# EasyEDA Pro project firefly_rp2354A.eprj, schematic Schematic1

## Sheets
1 P1: Board Name: Board1; Create Date: 2026-09-29; Page Name: P1; Project Name: firefly_rp2354A; Schematic Name: Schematic1; Update Date: 2026-10-07; Company: EasyEDA.com; Page Size: A4; Version: V1.0
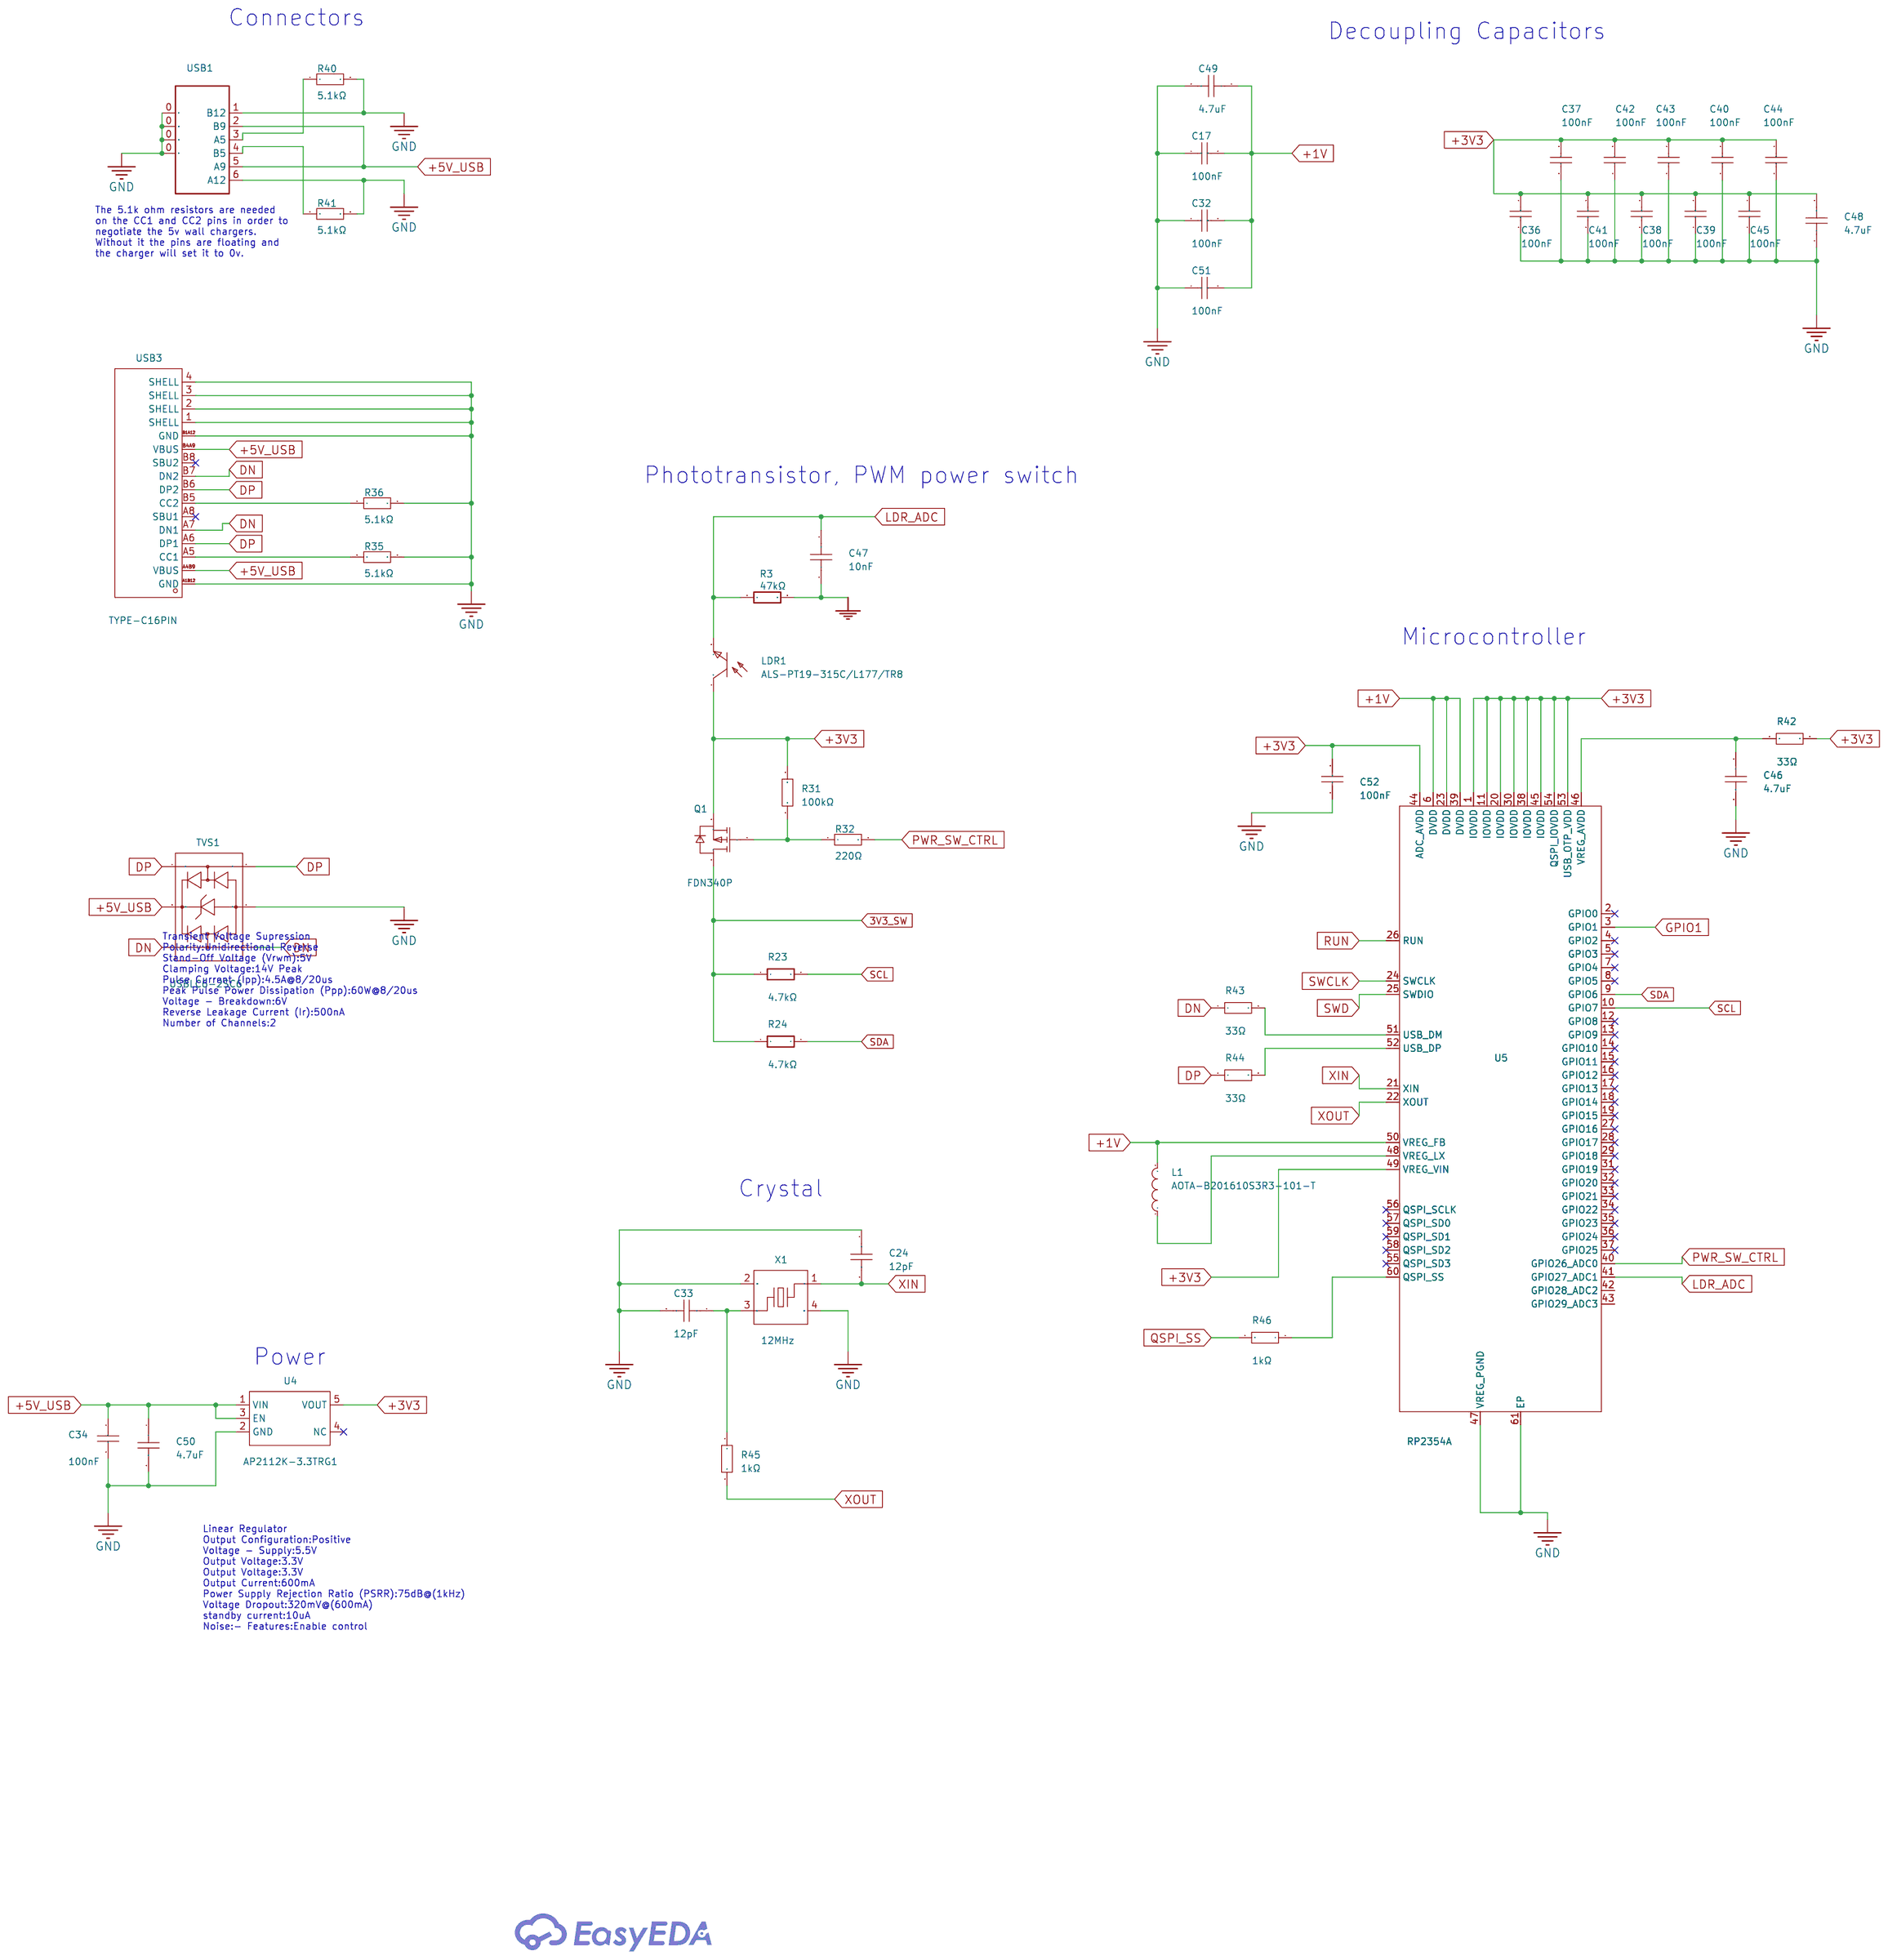
[diagram p0: P1]
2 P2: Create Date: 2026-10-05; Page Name: P2; Update Date: 2026-10-05
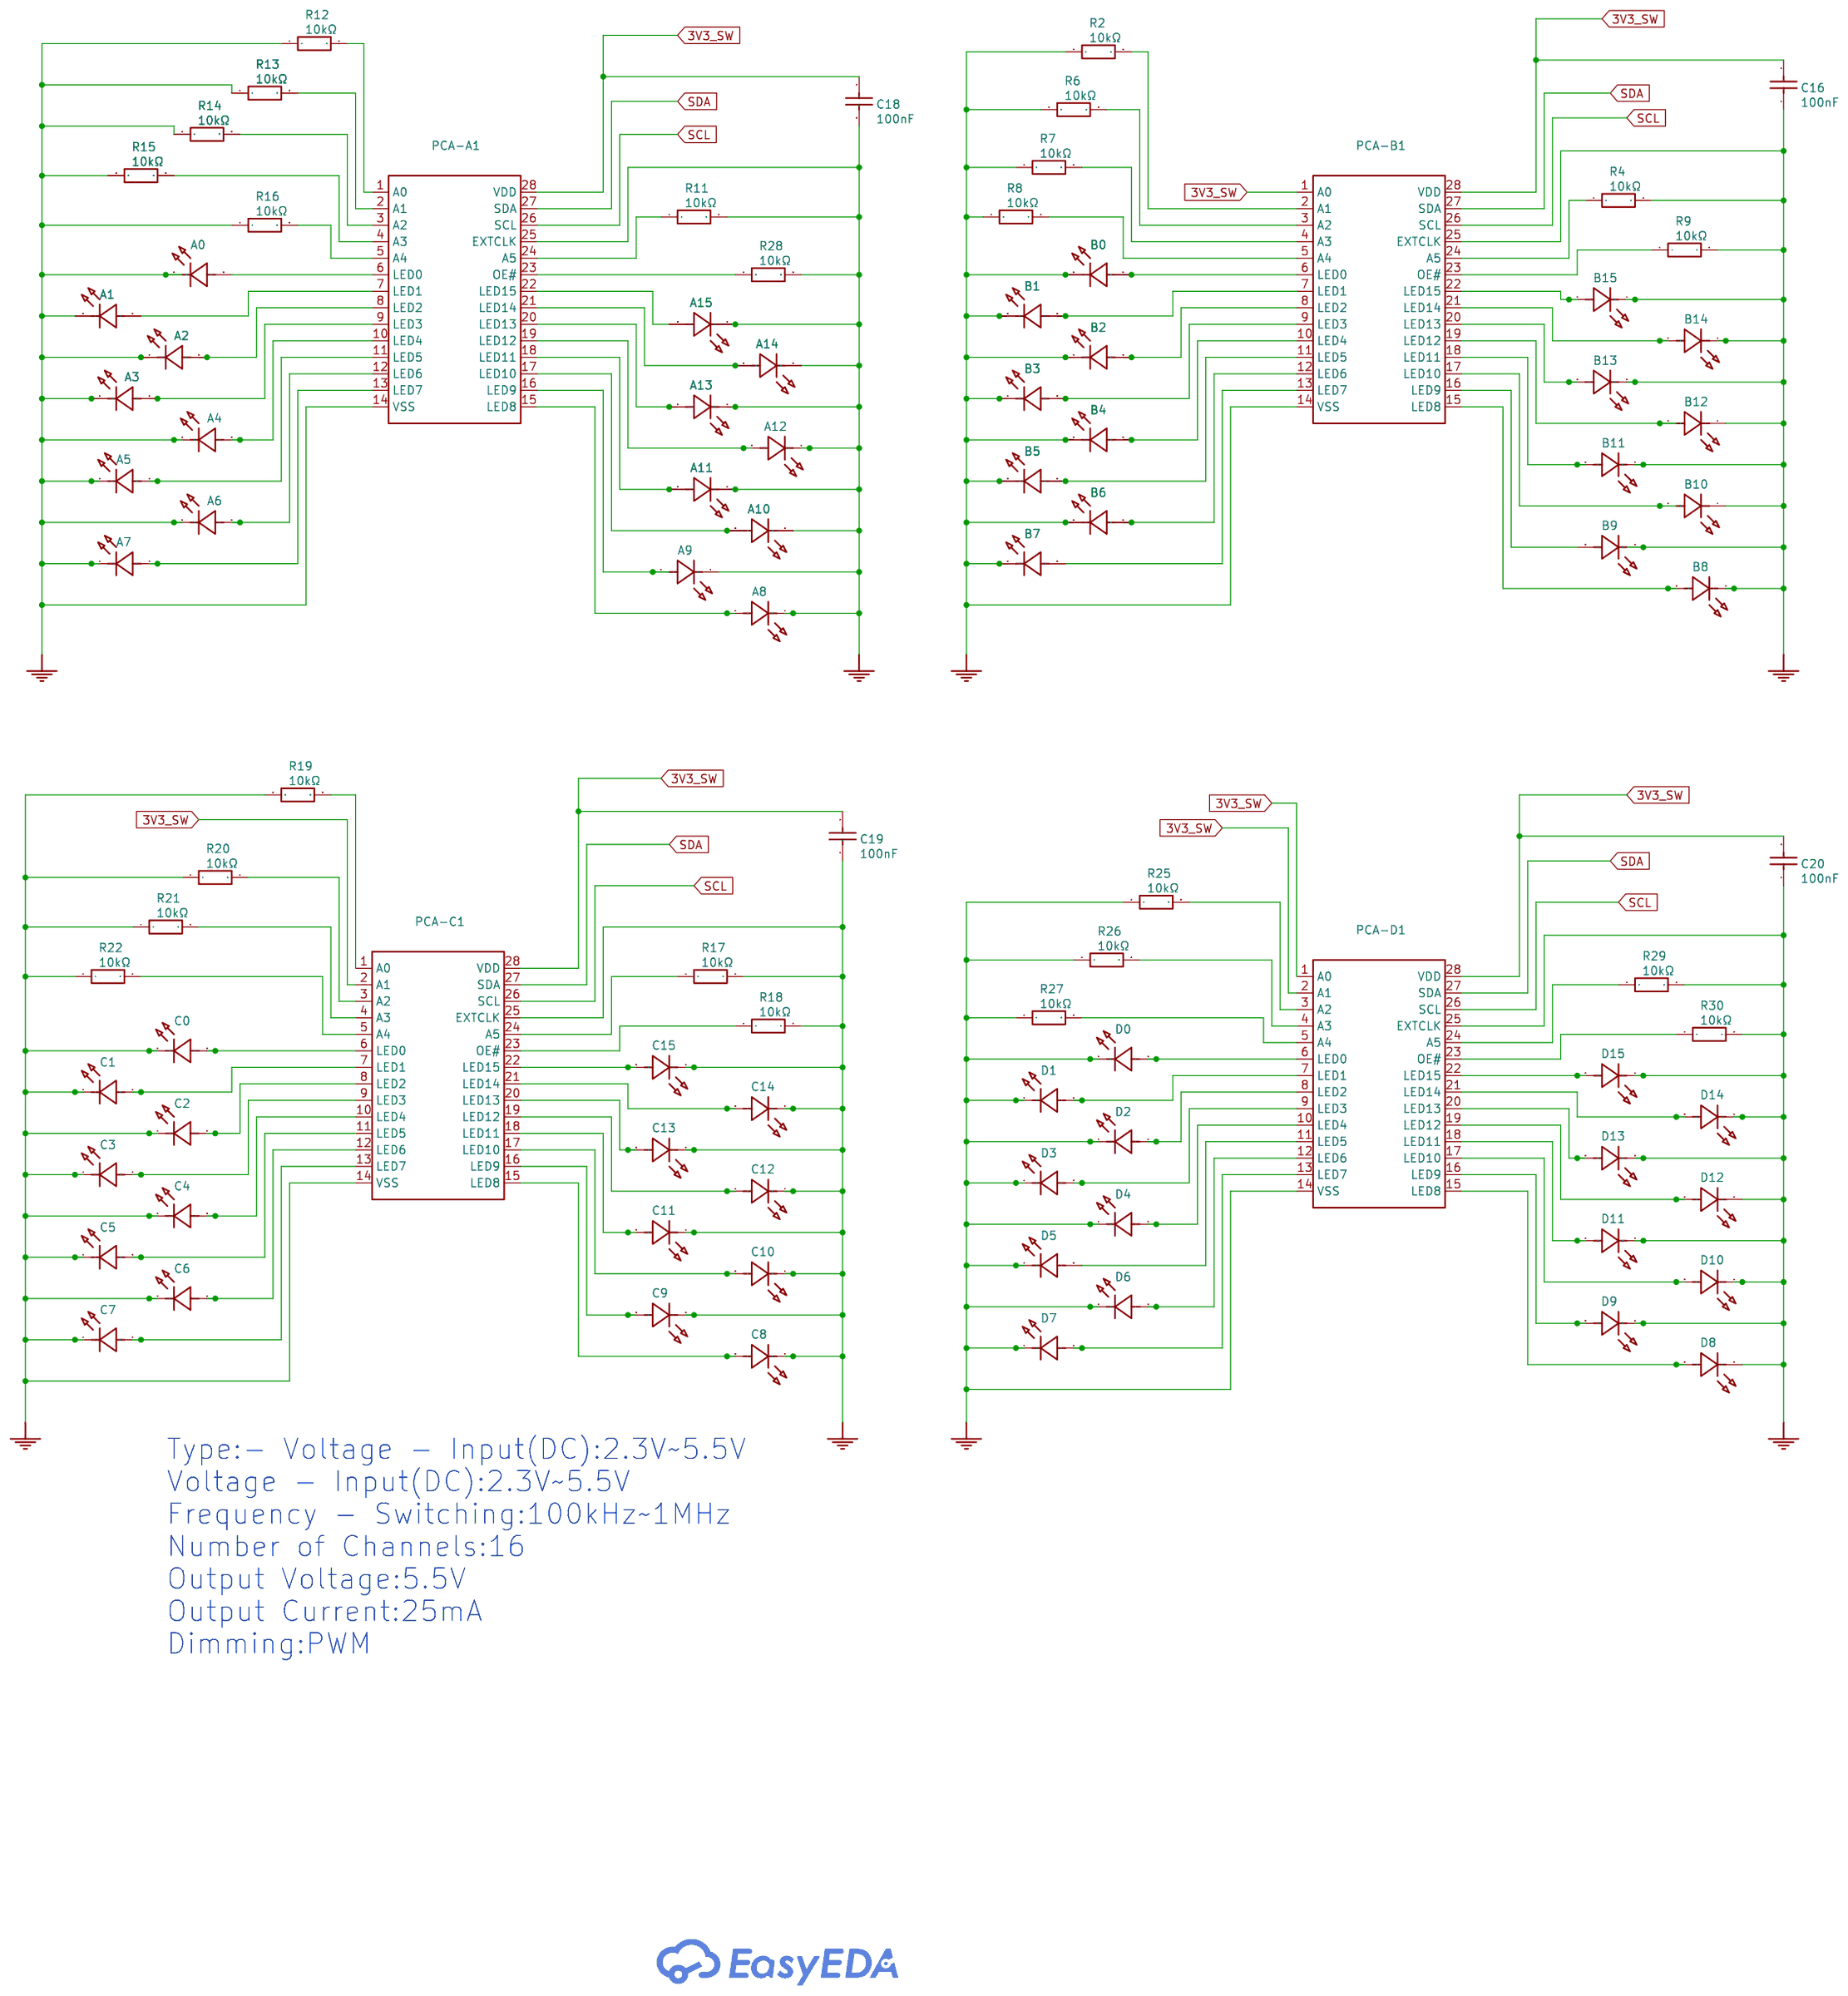
[diagram p1: P2]

## Parts
sheet P1
C17  100nF  [C0402]
C24  12pF  [C0603]
C32  100nF  [C0402]
C33  12pF  [C0603]
C34  100nF  [C0402]
C36  100nF  [C0402]
C37  100nF  [C0402]
C38  100nF  [C0402]
C39  100nF  [C0402]
C40  100nF  [C0402]
C41  100nF  [C0402]
C42  100nF  [C0402]
C43  100nF  [C0402]
C44  100nF  [C0402]
C45  100nF  [C0402]
C46  4.7uF  [C0603]
C47  10nF  [C0603]
C48  4.7uF  [C0603]
C49  4.7uF  [C0603]
C50  4.7uF  [C0603]
C51  100nF  [C0402]
C52  100nF  [C0402]
L1  AOTA-B201610S3R3-101-T  [IND-SMD_L2.0-W1.6_AOTA-B201610S3R3-101-T]
LDR1  ALS-PT19-315C/L177/TR8  [SENSORS-SMD_ALS-PT19]
Q1  FDN340P  [SOT-23-3_L3.0-W1.7-P0.95-LS2.9-BR]
R3  47kΩ  [R0603]
R23  4.7kΩ  [R0603]
R24  4.7kΩ  [R0603]
R31  100kΩ  [R0603]
R32  220Ω  [R0603]
R35  5.1kΩ  [R0603]
R36  5.1kΩ  [R0603]
R40  5.1kΩ  [R0603]
R41  5.1kΩ  [R0603]
R42  33Ω  [R0603]
R43  33Ω  [R0603]
R44  33Ω  [R0603]
R45  1kΩ  [R0603]
R46  1kΩ  [R0603]
TVS1  USBLC6-2SC6  [SOT-23-6_L2.9-W1.6-P0.95-LS2.8-BL]
U4  AP2112K-3.3TRG1  [SOT-23-5_L2.9-W1.6-P0.95-LS2.8-BR]
U5  RP2354A  [QFN-60_L7.0-W7.0-P0.40-TL-EP3.4]
USB1  USB-312-B-SU  [USB-C-SMD_10P-P1.00-L6.8-W8.9]
USB3  TYPE-C16PIN  [USB-C-SMD_TYPE-C16PIN]
X1  12MHz  [OSC-SMD_4P-L3.2-W2.5-BL]
sheet P2
A0  XL-2012WWC  [LED0805-RD_WHITE]
A1  XL-2012WWC  [LED0805-RD_WHITE]
A2  XL-2012WWC  [LED0805-RD_WHITE]
A3  XL-2012WWC  [LED0805-RD_WHITE]
A4  XL-2012WWC  [LED0805-RD_WHITE]
A5  XL-2012WWC  [LED0805-RD_WHITE]
A6  XL-2012WWC  [LED0805-RD_WHITE]
A7  XL-2012WWC  [LED0805-RD_WHITE]
A8  XL-2012WWC  [LED0805-RD_WHITE]
A9  XL-2012WWC  [LED0805-RD_WHITE]
A10  XL-2012WWC  [LED0805-RD_WHITE]
A11  XL-2012WWC  [LED0805-RD_WHITE]
A12  XL-2012WWC  [LED0805-RD_WHITE]
A13  XL-2012WWC  [LED0805-RD_WHITE]
A14  XL-2012WWC  [LED0805-RD_WHITE]
A15  XL-2012WWC  [LED0805-RD_WHITE]
B0  XL-2012WWC  [LED0805-RD_WHITE]
B1  XL-2012WWC  [LED0805-RD_WHITE]
B2  XL-2012WWC  [LED0805-RD_WHITE]
B3  XL-2012WWC  [LED0805-RD_WHITE]
B4  XL-2012WWC  [LED0805-RD_WHITE]
B5  XL-2012WWC  [LED0805-RD_WHITE]
B6  XL-2012WWC  [LED0805-RD_WHITE]
B7  XL-2012WWC  [LED0805-RD_WHITE]
B8  XL-2012WWC  [LED0805-RD_WHITE]
B9  XL-2012WWC  [LED0805-RD_WHITE]
B10  XL-2012WWC  [LED0805-RD_WHITE]
B11  XL-2012WWC  [LED0805-RD_WHITE]
B12  XL-2012WWC  [LED0805-RD_WHITE]
B13  XL-2012WWC  [LED0805-RD_WHITE]
B14  XL-2012WWC  [LED0805-RD_WHITE]
B15  XL-2012WWC  [LED0805-RD_WHITE]
C0  XL-2012WWC  [LED0805-RD_WHITE]
C1  XL-2012WWC  [LED0805-RD_WHITE]
C2  XL-2012WWC  [LED0805-RD_WHITE]
C3  XL-2012WWC  [LED0805-RD_WHITE]
C4  XL-2012WWC  [LED0805-RD_WHITE]
C5  XL-2012WWC  [LED0805-RD_WHITE]
C6  XL-2012WWC  [LED0805-RD_WHITE]
C7  XL-2012WWC  [LED0805-RD_WHITE]
C8  XL-2012WWC  [LED0805-RD_WHITE]
C9  XL-2012WWC  [LED0805-RD_WHITE]
C10  XL-2012WWC  [LED0805-RD_WHITE]
C11  XL-2012WWC  [LED0805-RD_WHITE]
C12  XL-2012WWC  [LED0805-RD_WHITE]
C13  XL-2012WWC  [LED0805-RD_WHITE]
C14  XL-2012WWC  [LED0805-RD_WHITE]
C15  XL-2012WWC  [LED0805-RD_WHITE]
C16  100nF  [C0402]
C18  100nF  [C0402]
C19  100nF  [C0402]
C20  100nF  [C0402]
D0  XL-2012WWC  [LED0805-RD_WHITE]
D1  XL-2012WWC  [LED0805-RD_WHITE]
D2  XL-2012WWC  [LED0805-RD_WHITE]
D3  XL-2012WWC  [LED0805-RD_WHITE]
D4  XL-2012WWC  [LED0805-RD_WHITE]
D5  XL-2012WWC  [LED0805-RD_WHITE]
D6  XL-2012WWC  [LED0805-RD_WHITE]
D7  XL-2012WWC  [LED0805-RD_WHITE]
D8  XL-2012WWC  [LED0805-RD_WHITE]
D9  XL-2012WWC  [LED0805-RD_WHITE]
D10  XL-2012WWC  [LED0805-RD_WHITE]
D11  XL-2012WWC  [LED0805-RD_WHITE]
D12  XL-2012WWC  [LED0805-RD_WHITE]
D13  XL-2012WWC  [LED0805-RD_WHITE]
D14  XL-2012WWC  [LED0805-RD_WHITE]
D15  XL-2012WWC  [LED0805-RD_WHITE]
PCA-A1  PCA9685PW,118  [TSSOP-28_L9.7-W4.4-P0.65-LS6.4-TL]
PCA-B1  PCA9685PW,118  [TSSOP-28_L9.7-W4.4-P0.65-LS6.4-TL]
PCA-C1  PCA9685PW,118  [TSSOP-28_L9.7-W4.4-P0.65-LS6.4-TL]
PCA-D1  PCA9685PW,118  [TSSOP-28_L9.7-W4.4-P0.65-LS6.4-TL]
R2  10kΩ  [R0603]
R4  10kΩ  [R0603]
R6  10kΩ  [R0603]
R7  10kΩ  [R0603]
R8  10kΩ  [R0603]
R9  10kΩ  [R0603]
R11  10kΩ  [R0603]
R12  10kΩ  [R0603]
R13  10kΩ  [R0603]
R14  10kΩ  [R0603]
R15  10kΩ  [R0603]
R16  10kΩ  [R0603]
R17  10kΩ  [R0603]
R18  10kΩ  [R0603]
R19  10kΩ  [R0603]
R20  10kΩ  [R0603]
R21  10kΩ  [R0603]
R22  10kΩ  [R0603]
R25  10kΩ  [R0603]
R26  10kΩ  [R0603]
R27  10kΩ  [R0603]
R28  10kΩ  [R0603]
R29  10kΩ  [R0603]
R30  10kΩ  [R0603]

## Library data of the parts
C16-C20 C32 C34 C36-C45 C51 C52 = FCC0402B104K160AT: Capacitance:100nF Tolerance:±10% Tolerance:±10% Voltage Rating:16V Temperature Coefficient:X7R Operating Temperature:-55℃~+125℃ Operating Temperature:-55℃~+125℃; LCSC Part Name: 100nF ±10% 16V; Supplier Part: C5137468; Manufacturer: FOJAN(富捷); Supplier Footprint: 0402; JLCPCB Part Class: Extended Part; Datasheet: https://item.szlcsc.com/datasheet/FCC0402B104K160AT/5746970.html; Supplier: LCSC; Tolerance: ±10%; Voltage Rating: 16V; Temperature Coefficient: X7R; Operating Temperature: -55℃~+125℃
C24 C33 = FCC0603N120J500CT: Capacitance:12pF Tolerance:±5% Tolerance:±5% Voltage Rating:50V Temperature Coefficient:C0G Operating Temperature:-55℃~+125℃ Operating Temperature:-55℃~+125℃; LCSC Part Name: 12pF ±5% 50V; Supplier Part: C5137591; Manufacturer: FOJAN(富捷); Supplier Footprint: 0603; JLCPCB Part Class: Extended Part; Datasheet: https://item.szlcsc.com/datasheet/FCC0603N120J500CT/5747043.html; Supplier: LCSC; Tolerance: ±5%; Voltage Rating: 50V; Temperature Coefficient: C0G; Operating Temperature: -55℃~+125℃
C46 = CL10A475KP8NNNC: Capacitance:4.7uF Tolerance:±10% Tolerance:±10% Voltage Rating:10V Temperature Coefficient:X5R; LCSC Part Name: 4.7uF ±10% 10V; Supplier Part: C1705; Manufacturer: SAMSUNG(三星); Supplier Footprint: 0603; JLCPCB Part Class: Extended Part; Datasheet: https://item.szlcsc.com/datasheet/CL10A475KP8NNNC/2057.html; Supplier: LCSC; Tolerance: ±10%; Voltage Rating: 10V; Temperature Coefficient: X5R
C47 = FN18X103K500PSG: Capacitance:10nF Tolerance:±10% Tolerance:±10% Voltage Rating:50V Temperature Coefficient:X7R; LCSC Part Name: 10nF ±10% 50V; Supplier Part: C525264; Manufacturer: PSA(信昌电陶); Supplier Footprint: 0603; JLCPCB Part Class: Extended Part; Datasheet: https://item.szlcsc.com/datasheet/FN18X103K500PSG/543391.html; Supplier: LCSC; Tolerance: ±10%; Voltage Rating: 50V; Temperature Coefficient: X7R
C48-C50 = TCC0603X5R475K160CT: Capacitance:4.7uF Tolerance:±10% Tolerance:±10% Voltage Rating:16V Temperature Coefficient:X5R; LCSC Part Name: 4.7uF ±10% 16V; Supplier Part: C380325; Manufacturer: CCTC(三环); Supplier Footprint: 0603; JLCPCB Part Class: Extended Part; Datasheet: https://item.szlcsc.com/datasheet/TCC0603X5R475K160CT/352730.html; Supplier: LCSC; Tolerance: ±10%; Voltage Rating: 16V; Temperature Coefficient: X5R
L1 = AOTA-B201610S3R3-101-T: LCSC Part Name: 3.3uH 2.4A; Supplier Part: C42411119; Manufacturer: ABRACON; Supplier Footprint: 0806; JLCPCB Part Class: Extended Part; Datasheet: https://item.szlcsc.com/datasheet/AOTA-B201610S3R3-101-T/44392932.html; Supplier: LCSC
LDR1 = ALS-PT19-315C/L177/TR8: Measurement Type:Light Intensity Voltage - Supply:2.5V~5.5V Voltage - Supply:2.5V~5.5V Operating Temperature:-40℃~+85℃ Operating Temperature:-40℃~+85℃ Length:1.7mm Width:0.8mm Height:0.6mm Features:Spectral correction/filtering; LCSC Part Name: 环境光传感器; Supplier Part: C146233; Manufacturer: EVERLIGHT(亿光); Supplier Footprint: 0603; JLCPCB Part Class: Extended Part; Datasheet: https://en.everlight.com/wp-content/plugins/ItemRelationship/product_files/pdf/ALS-PT19-315C-L177-TR8_V8.pdf; Supplier: LCSC; Measurement Type: Light Intensity; Voltage - Supply: 2.5V~5.5V; Operating Temperature: -40℃~+85℃; Length: 1.7mm; Width: 0.8mm; Height: 0.6mm; Features: Spectral correction/filtering
Q1 = FDN340P_C22365185: Drain to Source Voltage:20V Current - Continuous Drain(Id):3A RDS(on):142mΩ@2.5V Pd - Power Dissipation:400mW Gate Threshold Voltage (Vgs(th)):1V@250uA Gate Charge(Qg):6.6nC@4.5V Input Capacitance(Ciss):500pF Reverse Transfer Capacitance (Crss@Vds):80pF O; LCSC Part Name: P沟道贴片式MOSFET; Supplier Part: C22365185; Manufacturer: FUXINSEMI(富芯森美); Supplier Footprint: SOT-23; JLCPCB Part Class: Extended Part; Datasheet: https://item.szlcsc.com/datasheet/FDN340P/23829803.html; Supplier: LCSC; Drain to Source Voltage: 20V; Current - Continuous Drain(Id): 3A; RDS(on): 142mΩ@2.5V; Pd - Power Dissipation: 400mW; Gate Threshold Voltage (Vgs(th)): 1V@250uA; Gate Charge(Qg): 6.6nC@4.5V; Input Capacitance(Ciss): 500pF; Reverse Transfer Capacitance (Crss@Vds): 80pF; Operating Temperature: -55℃~+150℃; Output Capacitance(Coss): 120pF
R3 = 0603WAJ0473T5E: Type:Thick Film Resistor Resistance:47kΩ Tolerance:±5% Tolerance:±5% Power(Watts):100mW Voltage-Supply(Max):75V Temperature Coefficient:±100ppm/℃ Temperature Coefficient:±100ppm/℃ Operating Temperature:-55℃~+155℃ Operating Temperature:-55℃~+155℃; LCSC Part Name: 厚膜电阻 47kΩ ±5%; Supplier Part: C25600; Manufacturer: UNI-ROYAL(厚声); Supplier Footprint: 0603; JLCPCB Part Class: Extended Part; Datasheet: https://item.szlcsc.com/datasheet/0603WAJ0473T5E/26343.html; Supplier: LCSC; Type: Thick Film Resistor; Tolerance: ±5%; Power(Watts): 100mW; Voltage-Supply(Max): 75V; Temperature Coefficient: ±100ppm/℃; Operating Temperature: -55℃~+155℃
R23 R24 = FRC0603F4701TS: Type:Thick Film Resistor Resistance:4.7kΩ Tolerance:±1% Tolerance:±1% Power(Watts):100mW Voltage-Supply(Max):75V Temperature Coefficient:±100ppm/℃ Temperature Coefficient:±100ppm/℃ Operating Temperature:-55℃~+155℃ Operating Temperature:-55℃~+155℃; LCSC Part Name: 4.7kΩ ±1% 100mW 厚膜电阻; Supplier Part: C2907034; Manufacturer: FOJAN(富捷); Supplier Footprint: 0603; JLCPCB Part Class: Extended Part; Supplier: LCSC; Type: Thick Film Resistor; Tolerance: ±1%; Power(Watts): 100mW; Voltage-Supply(Max): 75V; Temperature Coefficient: ±100ppm/℃; Operating Temperature: -55℃~+155℃
R31 = FRC0603J104 TS: Type:Thick Film Resistor Resistance:100kΩ Tolerance:±5% Tolerance:±5% Power(Watts):100mW Voltage-Supply(Max):75V Temperature Coefficient:±100ppm/℃ Temperature Coefficient:±100ppm/℃ Operating Temperature:-55℃~+155℃ Operating Temperature:-55℃~+155℃; LCSC Part Name: 100kΩ ±5% 100mW 厚膜电阻; Supplier Part: C2907088; Manufacturer: FOJAN(富捷); Supplier Footprint: 0603; JLCPCB Part Class: Extended Part; Supplier: LCSC; Type: Thick Film Resistor; Tolerance: ±5%; Power(Watts): 100mW; Voltage-Supply(Max): 75V; Temperature Coefficient: ±100ppm/℃; Operating Temperature: -55℃~+155℃
R32 = FRC0603J221 TS: Type:Thick Film Resistor Resistance:220Ω Tolerance:±5% Tolerance:±5% Power(Watts):100mW Voltage-Supply(Max):75V Temperature Coefficient:±100ppm/℃ Temperature Coefficient:±100ppm/℃ Operating Temperature:-55℃~+155℃ Operating Temperature:-55℃~+155℃; LCSC Part Name: 220Ω ±5% 100mW 厚膜电阻; Supplier Part: C2907127; Manufacturer: FOJAN(富捷); Supplier Footprint: 0603; JLCPCB Part Class: Extended Part; Supplier: LCSC; Type: Thick Film Resistor; Tolerance: ±5%; Power(Watts): 100mW; Voltage-Supply(Max): 75V; Temperature Coefficient: ±100ppm/℃; Operating Temperature: -55℃~+155℃
R35 R36 R40 R41 = FRC0603F5101TS: Type:Thick Film Resistor Resistance:5.1kΩ Tolerance:±1% Tolerance:±1% Power(Watts):100mW Voltage-Supply(Max):75V Temperature Coefficient:±100ppm/℃ Temperature Coefficient:±100ppm/℃ Operating Temperature:-55℃~+155℃ Operating Temperature:-55℃~+155℃; LCSC Part Name: 5.1kΩ ±1% 100mW 厚膜电阻; Supplier Part: C2907044; Manufacturer: FOJAN(富捷); Supplier Footprint: 0603; JLCPCB Part Class: Extended Part; Supplier: LCSC; Type: Thick Film Resistor; Tolerance: ±1%; Power(Watts): 100mW; Voltage-Supply(Max): 75V; Temperature Coefficient: ±100ppm/℃; Operating Temperature: -55℃~+155℃
R42-R44 = FRC0603F33R0TS: Type:Thick Film Resistor Resistance:33Ω Tolerance:±1% Tolerance:±1% Power(Watts):100mW Voltage-Supply(Max):75V Temperature Coefficient:±100ppm/℃ Temperature Coefficient:±100ppm/℃ Operating Temperature:-55℃~+155℃ Operating Temperature:-55℃~+155℃; LCSC Part Name: 33Ω ±1% 100mW 厚膜电阻; Supplier Part: C2909394; Manufacturer: FOJAN(富捷); Supplier Footprint: 0603; JLCPCB Part Class: Extended Part; Datasheet: https://item.szlcsc.com/datasheet/FRC0603F33R0TS/3186329.html; Supplier: LCSC; Type: Thick Film Resistor; Tolerance: ±1%; Power(Watts): 100mW; Voltage-Supply(Max): 75V; Temperature Coefficient: ±100ppm/℃; Operating Temperature: -55℃~+155℃
R45 R46 = HRC0603F1001ENTN: Type:Thick Film Resistor Resistance:1kΩ Tolerance:±1% Tolerance:±1% Power(Watts):100mW Voltage-Supply(Max):50V Temperature Coefficient:±100ppm/℃ Temperature Coefficient:±100ppm/℃ Operating Temperature:-55℃~+155℃ Operating Temperature:-55℃~+155℃; LCSC Part Name: 厚膜电阻; Supplier Part: C54920868; Manufacturer: HC(华橙熊猫); Supplier Footprint: 0603; JLCPCB Part Class: Extended Part; Datasheet: https://item.szlcsc.com/datasheet/HRC0603F1001ENTN/58459596.html; Supplier: LCSC; Type: Thick Film Resistor; Tolerance: ±1%; Power(Watts): 100mW; Voltage-Supply(Max): 50V; Temperature Coefficient: ±100ppm/℃; Operating Temperature: -55℃~+155℃
TVS1 = USBLC6-2SC6_C21713975: Polarity:Unidirectional Reverse Stand-Off Voltage (Vrwm):5V Clamping Voltage:14V Peak Pulse Current (Ipp):4.5A@8/20us Peak Pulse Power Dissipation (Ppp):60W@8/20us Voltage - Breakdown:6V Reverse Leakage Current (Ir):500nA Number of Channels:2 Operating Te; LCSC Part Name: 丝印UL26 单向TVS 5V截止 峰值脉冲电流：4.5A@8/20us; Supplier Part: C21713975; Manufacturer: GOODWORK(固得沃克); Supplier Footprint: SOT-23-6; JLCPCB Part Class: Extended Part; Datasheet: https://item.szlcsc.com/datasheet/USBLC6-2SC6/23140168.html; Supplier: LCSC; Polarity: Unidirectional; Reverse Stand-Off Voltage (Vrwm): 5V; Clamping Voltage: 14V; Peak Pulse Current (Ipp): 4.5A@8/20us; Peak Pulse Power Dissipation (Ppp): 60W@8/20us; Voltage - Breakdown: 6V; Reverse Leakage Current (Ir): 500nA; Number of Channels: 2; Operating Temperature: -55℃~+125℃; level of protection: IEC 61000-4-5；IEC 61000-4-2; Type: TVS; Junction Capacitance: 0.6pF
U4 = AP2112K-3.3TRG1_C23380830: Output Configuration:Positive Voltage - Supply:5.5V Output Voltage:3.3V Output Voltage:3.3V Output Current:600mA Power Supply Rejection Ratio (PSRR):75dB@(1kHz) Voltage Dropout:320mV@(600mA) standby current:10uA Noise:- Features:Enable control；Over Curren; LCSC Part Name: 3.3V 600mA 5.5V; Supplier Part: C23380830; Manufacturer: TECH PUBLIC(台舟); Supplier Footprint: SOT-23-5; JLCPCB Part Class: Extended Part; Datasheet: https://item.szlcsc.com/datasheet/AP2112K-3.3TRG1/25111500.html; Supplier: LCSC; Output Configuration: Positive; Voltage - Supply: 5.5V; Output Voltage: 3.3V; Output Current: 600mA; Power Supply Rejection Ratio (PSRR): 75dB@(1kHz); Voltage Dropout: 320mV@(600mA); standby current: 10uA; Features: Enable control；Over Current Protection；Output discharge；Thermal shutdown; Operating Temperature: -40℃~+85℃@(Ta); Output Type: Fixed; Number of Outputs: 1
U5 = RP2354A: LCSC Part Name: SC1511(13)-A4; Supplier Part: C41378174; Manufacturer: Raspberry Pi(树莓派); Supplier Footprint: QFN-60(7x7); JLCPCB Part Class: Extended Part; Datasheet: https://item.szlcsc.com/datasheet/RP2354A/43147979.html; Supplier: LCSC; CPU Core: ARM Cortex-M33; CPU Maximum Speed: 150MHz; Core Size: 32 Bit; Oscillator Type: Built-in+External; Features: Independent watchdog (IWDG)；Undervoltage detection (BOR/LVD/LVR/LVI)；Calendar function；Power-on reset (POR)；True random number generator (TRNG)；Watchdog reset；Built-in general-purpose timer；Hardware ECC check；Integrated LDO
USB1 = USB-312-B-SU: Connector Type:Type-C Protocol Standard:- Gender:Female Mounting Type:Surface Mount, Right Angle Number of Contacts:6P Number of Ports:1 Current Rating-Power:3.5A Voltage Rating:5V Length:6.9mm Operating Temperature:-20℃~+60℃ Operating Temperature:-20℃~+6; LCSC Part Name: Type-C 母 卧贴; Supplier Part: C309366; Manufacturer: HOOYA(皓宇电子); Supplier Footprint: SMD; JLCPCB Part Class: Extended Part; Datasheet: https://item.szlcsc.com/datasheet/USB-312-B-SU/293027.html; Supplier: LCSC; Connector Type: Type-C; Gender: Female; Mounting Type: Surface Mount, Right Angle; Number of Contacts: 6P; Number of Ports: 1; Current Rating-Power: 3.5A; Voltage Rating: 5V; Length: 6.9mm; Operating Temperature: -20℃~+60℃
USB3 = TYPE-C16PIN: Connector Type:Type-C Protocol Standard:- Gender:Female Mounting Type:Surface Mount, Right Angle Number of Contacts:16P Number of Ports:1 Current Rating-Power:3A Voltage Rating:30V Connect-Disconnect Life:10,000 Cycles Supplementary Features:- Center Heig; LCSC Part Name: 16P卧贴母座; Supplier Part: C393939; Manufacturer: SHOU HAN(首韩); Supplier Footprint: SMD; JLCPCB Part Class: Extended Part; Datasheet: https://item.szlcsc.com/datasheet/TYPE-C16PIN/372551.html; Supplier: LCSC; Connector Type: Type-C; Gender: Female; Mounting Type: Surface Mount, Right Angle; Number of Contacts: 16P; Number of Ports: 1; Current Rating-Power: 3A; Voltage Rating: 30V; Connect-Disconnect Life: 10,000 Cycles; Detection color: Black; Operating Temperature: -40℃~+85℃
X1 = TXM12M0004322CBCDO00T: LCSC Part Name: 12MHz ±10ppm 9pF; Supplier Part: C362368; Manufacturer: YJX(雅晶鑫); Supplier Footprint: SMD3225-4P; JLCPCB Part Class: Extended Part; Datasheet: https://item.szlcsc.com/datasheet/TXM12M0004322CBCDO00T/337108.html; Supplier: LCSC; Type: SMD crystal oscillator; Normal temperature Frequency Tolerance: ±10ppm; Load Capacitance: 9pF; Frequency Stability: ±20ppm; Equivalent Series Resistance(ESR): 60Ω; Operating Temperature: -40℃~+85℃
A0-A15 B0-B15 C0-C15 D0-D15 = XL-2012WWC: Supplier: LCSC; Supplier Part: C965820; Manufacturer: XINGLIGHT(成兴光); JLCPCB Part Class: Extended Part; Contributor: lcsc; spicePre: L
PCA-A1 PCA-B1 PCA-C1 PCA-D1 = PCA9685PW,118: Type:- Voltage - Input(DC):2.3V~5.5V Voltage - Input(DC):2.3V~5.5V Frequency - Switching:100kHz~1MHz Frequency - Switching:100kHz~1MHz Number of Channels:16 Output Voltage:5.5V Output Voltage:5.5V Output Current:25mA Dimming:PWM Features:- Operating tempe; LCSC Part Name: 16通道、12位PWM Fm+ I2C总线LED控制器; Supplier Part: C2678753; Manufacturer: NXP(恩智浦); Supplier Footprint: TSSOP-28; JLCPCB Part Class: Extended Part; Datasheet: https://www.nxp.com.cn/docs/en/data-sheet/PCA9685.pdf; Supplier: LCSC; Voltage - Input(DC): 2.3V~5.5V; Frequency - Switching: 100kHz~1MHz; Number of Channels: 16; Output Voltage: 5.5V; Output Current: 25mA; Dimming: PWM; Operating temperature: -40℃~+85℃; Switch Tube (Built-In/External): Built-in
R2 R4 R6-R9 R11-R22 R25-R30 = AC0603FR-0710KL: Type:Thick Film Resistors Resistance: Tolerance:±1% Tolerance:±1% Power(Watts): Overload Voltage (Max): Temperature Coefficient:±100ppm/℃ Temperature Coefficient:±100ppm/℃ Operating Temperature Range:-55℃~+155℃ Operating Temperature Range:-55℃~+155℃; LCSC Part Name: 厚膜电阻 10kΩ ±1% 100mW; Supplier Part: C116677; Manufacturer: YAGEO(国巨); Supplier Footprint: 0603; JLCPCB Part Class: Extended Part; Datasheet: https://atta.szlcsc.com/upload/public/pdf/source/20180927/C229861_4ABDC471507C1ED6AFB4BA66AFC8620A.pdf; Supplier: LCSC; Type: Thick Film Resistors; Tolerance: ±1%; Temperature Coefficient: ±100ppm/℃; Operating Temperature Range: -55℃~+155℃

## Nets
3V3_SW: C16.2 C18.2 C19.2 C20.2 PCA-A1.28(VDD) PCA-B1.1(A0) PCA-B1.28(VDD) PCA-C1.2(A1) PCA-C1.28(VDD) PCA-D1.1(A0) PCA-D1.2(A1) PCA-D1.28(VDD) Q1.3(D) R23.1 R24.1
+1V: C17.2 C32.2 C49.1 C51.2 L1.2 U5.6(DVDD) U5.23(DVDD) U5.39(DVDD) U5.50(VREG_FB)
+3V3: C36.2 C37.2 C38.2 C39.2 C40.2 C41.2 C42.2 C43.2 C44.2 C45.2 C48.2 C52.1 LDR1.1(C) Q1.2(S) R31.2 R42.2 U4.5(VOUT) U5.1(IOVDD) U5.11(IOVDD) U5.20(IOVDD) U5.30(IOVDD) U5.38(IOVDD) U5.44(ADC_AVDD) U5.45(IOVDD) U5.49(VREG_VIN) U5.53(USB_OTP_VDD) U5.54(QSPI_IOVDD)
+5V_USB: C34.2 C50.1 TVS1.5(VBUS) U4.1(VIN) U4.3(EN) USB1.2(B9) USB1.5(A9) USB3.A4B9(VBUS) USB3.B4A9(VBUS)
GND: A0.1(K) A1.1(K) A2.1(K) A3.1(K) A4.1(K) A5.1(K) A6.1(K) A7.1(K) A8.1(K) A9.1(K) A10.1(K) A11.1(K) A12.1(K) A13.1(K) A14.1(K) A15.1(K) B0.1(K) B1.1(K) B2.1(K) B3.1(K) B4.1(K) B5.1(K) B6.1(K) B7.1(K) B8.1(K) B9.1(K) B10.1(K) B11.1(K) B12.1(K) B13.1(K) B14.1(K) B15.1(K) C0.1(K) C1.1(K) C2.1(K) C3.1(K) C4.1(K) C5.1(K) C6.1(K) C7.1(K) C8.1(K) C9.1(K) C10.1(K) C11.1(K) C12.1(K) C13.1(K) C14.1(K) C15.1(K) C16.1 C17.1 C18.1 C19.1 C20.1 C24.1 C32.1 C33.2 C34.1 C36.1 C37.1 C38.1 C39.1 C40.1 C41.1 C42.1 C43.1 C44.1 C45.1 C46.2 C47.2 C48.1 C49.2 C50.2 C51.1 C52.2 D0.1(K) D1.1(K) D2.1(K) D3.1(K) D4.1(K) D5.1(K) D6.1(K) D7.1(K) D8.1(K) D9.1(K) D10.1(K) D11.1(K) D12.1(K) D13.1(K) D14.1(K) D15.1(K) PCA-A1.14(VSS) PCA-A1.25(EXTCLK) PCA-B1.14(VSS) PCA-B1.25(EXTCLK) PCA-C1.14(VSS) PCA-C1.25(EXTCLK) PCA-D1.14(VSS) PCA-D1.25(EXTCLK) R2.1 R3.2 R4.2 R6.1 R7.1 R8.1 R9.2 R11.2 R12.1 R13.1 R14.1 R15.1 R16.1 R17.2 R18.2 R19.1 R20.1 R21.1 R22.1 R25.1 R26.1 R27.1 R28.2 R29.2 R30.2 R35.2 R36.2 R40.2 R41.2 TVS1.2(GND) U4.2(GND) U5.47(VREG_PGND) U5.61(EP) USB1.0 USB1.1(B12) USB1.6(A12) USB3.1(SHELL) USB3.2(SHELL) USB3.3(SHELL) USB3.4(SHELL) USB3.A1B12(GND) USB3.B1A12(GND) X1.2(GND) X1.4(GND)
DN: R43.1 TVS1.1(I/O1) TVS1.6(I/O1) USB3.A7(DN1) USB3.B7(DN2)
DP: R44.1 TVS1.3(I/O2) TVS1.4(I/O2) USB3.A6(DP1) USB3.B6(DP2)
GPIO1: U5.3(GPIO1)
LDR_ADC: C47.1 LDR1.2(E) R3.1 U5.41(GPIO27_ADC1)
PWR_SW_CTRL: R32.2 U5.40(GPIO26_ADC0)
QSPI_SS: R46.2
RUN: U5.26(RUN)
SCL: PCA-A1.26(SCL) PCA-B1.26(SCL) PCA-C1.26(SCL) PCA-D1.26(SCL) R23.2 U5.10(GPIO7)
SDA: PCA-A1.27(SDA) PCA-B1.27(SDA) PCA-C1.27(SDA) PCA-D1.27(SDA) R24.2 U5.9(GPIO6)
SWCLK: U5.24(SWCLK)
SWD: U5.25(SWDIO)
XIN: C24.2 U5.21(XIN) X1.1
XOUT: R45.2 U5.22(XOUT)
$1N2211: Q1.1(G) R31.1 R32.1
$1N2238: R35.1 USB3.A5(CC1)
$1N2239: R36.1 USB3.B5(CC2)
$1N2269: R40.1 USB1.3(A5)
$1N2270: R41.1 USB1.4(B5)
$1N2837: R43.2 U5.51(USB_DM)
$1N2842: R44.2 U5.52(USB_DP)
$1N3610: C46.1 R42.1 U5.46(VREG_AVDD)
$1N8250: C33.1 R45.1 X1.3
$1N8339: L1.1 U5.48(VREG_LX)
$1N8471: R46.1 U5.60(QSPI_SS)
$2N3702: A1.2(A) PCA-A1.7(LED1)
$2N3703: A2.2(A) PCA-A1.8(LED2)
$2N3704: A3.2(A) PCA-A1.9(LED3)
$2N3705: A5.2(A) PCA-A1.11(LED5)
$2N3706: A6.2(A) PCA-A1.12(LED6)
$2N3707: A7.2(A) PCA-A1.13(LED7)
$2N3708: A4.2(A) PCA-A1.10(LED4)
$2N3710: A0.2(A) PCA-A1.6(LED0)
$2N3711: B0.2(A) PCA-B1.6(LED0)
$2N3713: B4.2(A) PCA-B1.10(LED4)
$2N3714: B7.2(A) PCA-B1.13(LED7)
$2N3715: B6.2(A) PCA-B1.12(LED6)
$2N3716: B5.2(A) PCA-B1.11(LED5)
$2N3717: B3.2(A) PCA-B1.9(LED3)
$2N3718: B2.2(A) PCA-B1.8(LED2)
$2N3719: B1.2(A) PCA-B1.7(LED1)
$2N3720: C1.2(A) PCA-C1.7(LED1)
$2N3721: C2.2(A) PCA-C1.8(LED2)
$2N3722: C3.2(A) PCA-C1.9(LED3)
$2N3723: C5.2(A) PCA-C1.11(LED5)
$2N3724: C6.2(A) PCA-C1.12(LED6)
$2N3725: C7.2(A) PCA-C1.13(LED7)
$2N3726: C4.2(A) PCA-C1.10(LED4)
$2N3728: C0.2(A) PCA-C1.6(LED0)
$2N3742: PCA-B1.23(OE#) R9.1
$2N3743: PCA-B1.2(A1) R2.2
$2N3744: PCA-B1.3(A2) R6.2
$2N3745: PCA-B1.4(A3) R7.2
$2N3746: PCA-B1.5(A4) R8.2
$2N3747: PCA-B1.24(A5) R4.1
$2N3748: PCA-A1.23(OE#) R28.1
$2N3749: PCA-A1.24(A5) R11.1
$2N3750: PCA-A1.1(A0) R12.2
$2N3751: PCA-A1.2(A1) R13.2
$2N3752: PCA-A1.3(A2) R14.2
$2N3753: PCA-A1.4(A3) R15.2
$2N3754: PCA-A1.5(A4) R16.2
$2N3755: PCA-C1.24(A5) R17.1
$2N3757: PCA-C1.23(OE#) R18.1
$2N3758: PCA-C1.1(A0) R19.2
$2N3759: PCA-C1.3(A2) R20.2
$2N3760: PCA-C1.4(A3) R21.2
$2N3761: PCA-C1.5(A4) R22.2
$2N3763: PCA-D1.5(A4) R27.2
$2N3764: PCA-D1.4(A3) R26.2
$2N3767: PCA-D1.23(OE#) R30.1
$2N3768: PCA-D1.24(A5) R29.1
$2N3773: D0.2(A) PCA-D1.6(LED0)
$2N3774: D4.2(A) PCA-D1.10(LED4)
$2N3775: D7.2(A) PCA-D1.13(LED7)
$2N3776: D6.2(A) PCA-D1.12(LED6)
$2N3777: D5.2(A) PCA-D1.11(LED5)
$2N3778: D3.2(A) PCA-D1.9(LED3)
$2N3779: D2.2(A) PCA-D1.8(LED2)
$2N3780: D1.2(A) PCA-D1.7(LED1)
$2N3781: PCA-D1.3(A2) R25.2
$2N3782: A15.2(A) PCA-A1.22(LED15)
$2N3783: A14.2(A) PCA-A1.21(LED14)
$2N3784: A13.2(A) PCA-A1.20(LED13)
$2N3785: A12.2(A) PCA-A1.19(LED12)
$2N3786: A11.2(A) PCA-A1.18(LED11)
$2N3787: A10.2(A) PCA-A1.17(LED10)
$2N3788: A9.2(A) PCA-A1.16(LED9)
$2N3789: A8.2(A) PCA-A1.15(LED8)
$2N3790: B15.2(A) PCA-B1.22(LED15)
$2N3791: B14.2(A) PCA-B1.21(LED14)
$2N3792: B13.2(A) PCA-B1.20(LED13)
$2N3793: B12.2(A) PCA-B1.19(LED12)
$2N3794: B11.2(A) PCA-B1.18(LED11)
$2N3795: B10.2(A) PCA-B1.17(LED10)
$2N3796: B9.2(A) PCA-B1.16(LED9)
$2N3797: B8.2(A) PCA-B1.15(LED8)
$2N3798: C15.2(A) PCA-C1.22(LED15)
$2N3799: C14.2(A) PCA-C1.21(LED14)
$2N3800: C13.2(A) PCA-C1.20(LED13)
$2N3801: C12.2(A) PCA-C1.19(LED12)
$2N3802: C11.2(A) PCA-C1.18(LED11)
$2N3803: C10.2(A) PCA-C1.17(LED10)
$2N3804: C9.2(A) PCA-C1.16(LED9)
$2N3805: C8.2(A) PCA-C1.15(LED8)
$2N3806: D15.2(A) PCA-D1.22(LED15)
$2N3807: D13.2(A) PCA-D1.20(LED13)
$2N3808: D14.2(A) PCA-D1.21(LED14)
$2N3809: D12.2(A) PCA-D1.19(LED12)
$2N3810: D11.2(A) PCA-D1.18(LED11)
$2N3811: D10.2(A) PCA-D1.17(LED10)
$2N3812: D9.2(A) PCA-D1.16(LED9)
$2N3813: D8.2(A) PCA-D1.15(LED8)

Not connected (* = marked no-connect by the designer): U4 4(NC)*; U5 2(GPIO0)* 4(GPIO2)* 5(GPIO3)* 7(GPIO4)* 8(GPIO5)* 12(GPIO8)* 13(GPIO9)* 14(GPIO10)* 15(GPIO11)* 16(GPIO12)* 17(GPIO13)* 18(GPIO14)* 19(GPIO15)* 27(GPIO16)* 28(GPIO17)* 29(GPIO18)* 31(GPIO19)* 32(GPIO20)* 33(GPIO21)* 34(GPIO22)* 35(GPIO23)* 36(GPIO24)* 37(GPIO25)* 42(GPIO28_ADC2) 43(GPIO29_ADC3) 55(QSPI_SD3)* 56(QSPI_SCLK)* 57(QSPI_SD0)* 58(QSPI_SD2)* 59(QSPI_SD1)*; USB3 A8(SBU1)* B8(SBU2)*

## Notes on the sheets
sheet 1
- Connectors
- Decoupling Capacitors
- The 5.1k ohm resistors are needed
  on the CC1 and CC2 pins in order to
  negotiate the 5v wall chargers.
  Without it the pins are floating and
  the charger will set it to 0v.
- Phototransistor, PWM power switch
- Microcontroller
- Transient Voltage Supression
  Polarity:Unidirectional Reverse
  Stand-Off Voltage (Vrwm):5V
  Clamping Voltage:14V Peak
  Pulse Current (Ipp):4.5A@8/20us
  Peak Pulse Power Dissipation (Ppp):60W@8/20us
  Voltage - Breakdown:6V
  Reverse Leakage Current (Ir):500nA
  Number of Channels:2
- Crystal
- Power
- Linear Regulator
  Output Configuration:Positive
  Voltage - Supply:5.5V
  Output Voltage:3.3V
  Output Voltage:3.3V
  Output Current:600mA
  Power Supply Rejection Ratio (PSRR):75dB@(1kHz)
  Voltage Dropout:320mV@(600mA)
  standby current:10uA
  Noise:- Features:Enable control
sheet 2
- Type:- Voltage - Input(DC):2.3V~5.5V
  Voltage - Input(DC):2.3V~5.5V
  Frequency - Switching:100kHz~1MHz
  Number of Channels:16
  Output Voltage:5.5V
  Output Current:25mA
  Dimming:PWM
